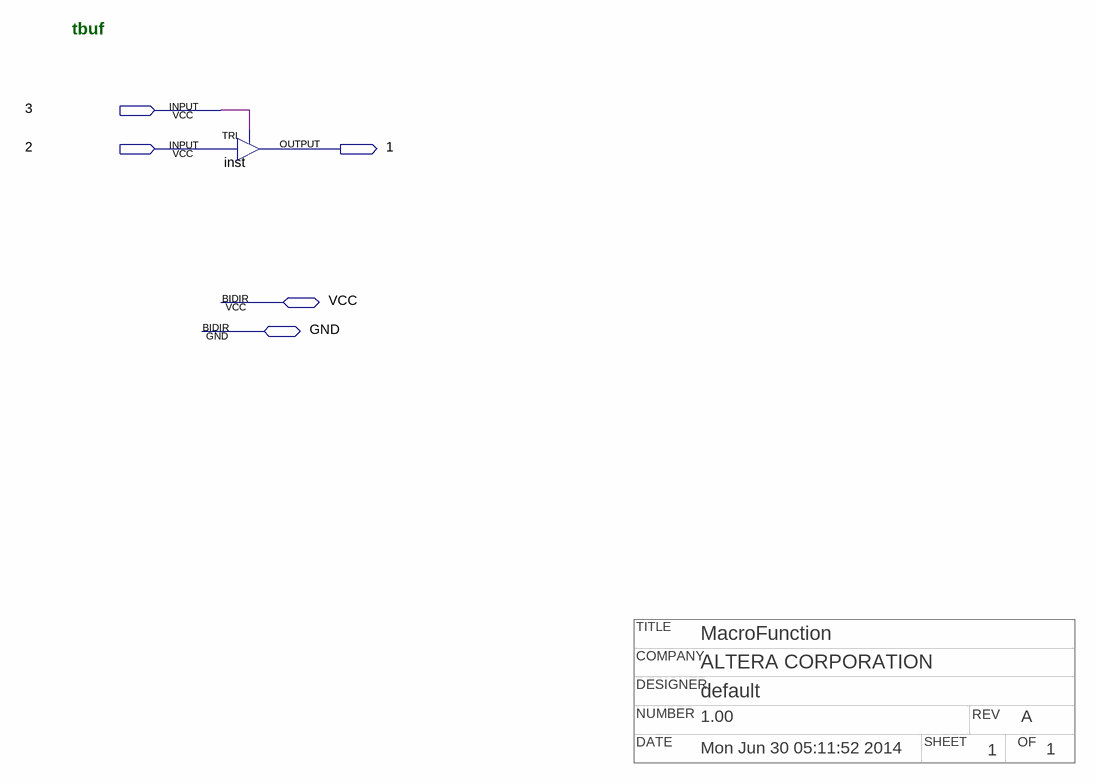
[diagram p0: schematic sheet]
// Quartus schematic nptbuf.bdf as structural Verilog: 1 symbols, 5 pins
// Title block: TITLE: MacroFunction; COMPANY: ALTERA CORPORATION; DESIGNER: default; NUMBER: 1.00; REV: A; DATE: Mon Jun 30 05:11:52 2014; SHEET: 1; OF: 1
module nptbuf (
  input  \3 ,
  input  \2 ,
  inout  VCC,
  inout  GND,
  output \1 
);

  TRI inst (.IN(\2 ), .OE(\3 ), .OUT(\1 ));

  // Notes on the sheet:
  //   tbuf
endmodule
